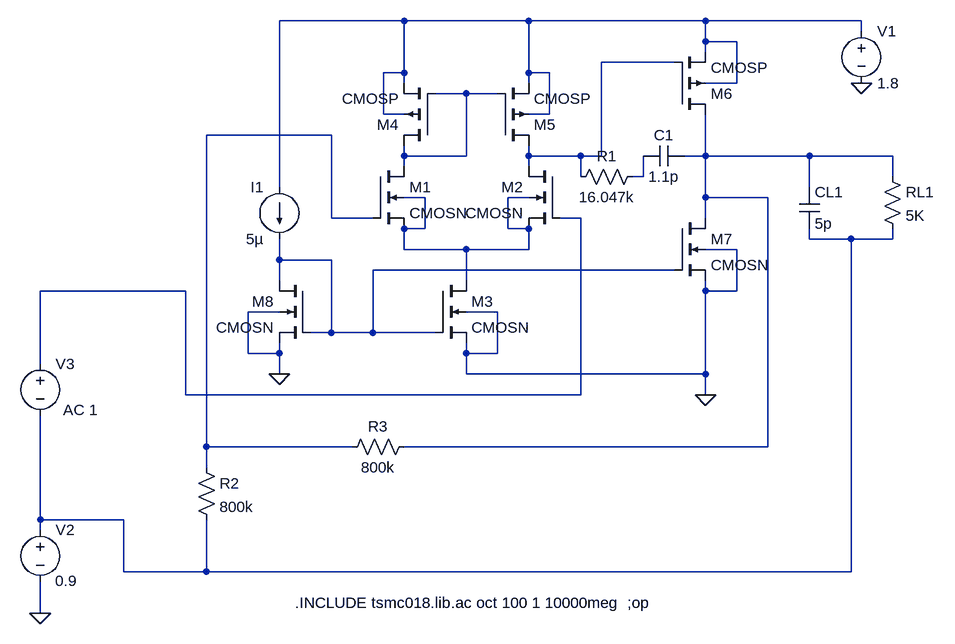
[diagram p0: schematic 2-stageOpamp_closeloop.asc]
2-stageOpamp_closeloop.asc, the LTspice schematic file:
Version 4
SHEET 1 880 680
WIRE -496 -544 -688 -544
WIRE -304 -544 -496 -544
WIRE -32 -544 -304 -544
WIRE 208 -544 -32 -544
WIRE 208 -528 208 -544
WIRE -32 -512 -32 -544
WIRE 16 -512 -32 -512
WIRE -32 -496 -32 -512
WIRE -80 -480 -192 -480
WIRE -496 -464 -496 -544
WIRE -496 -464 -528 -464
WIRE -304 -464 -304 -544
WIRE -272 -464 -304 -464
WIRE -496 -448 -496 -464
WIRE -304 -448 -304 -464
WIRE 16 -448 16 -512
WIRE 16 -448 -32 -448
WIRE -400 -432 -448 -432
WIRE -352 -432 -400 -432
WIRE -528 -400 -528 -464
WIRE -496 -400 -528 -400
WIRE -272 -400 -272 -464
WIRE -272 -400 -304 -400
WIRE -608 -368 -800 -368
WIRE -496 -336 -496 -352
WIRE -400 -336 -400 -432
WIRE -400 -336 -496 -336
WIRE -304 -336 -304 -352
WIRE -224 -336 -304 -336
WIRE -192 -336 -192 -480
WIRE -192 -336 -224 -336
WIRE -32 -336 -32 -400
WIRE -32 -336 -64 -336
WIRE 128 -336 -32 -336
WIRE 256 -336 128 -336
WIRE -496 -320 -496 -336
WIRE -304 -320 -304 -336
WIRE -224 -304 -224 -336
WIRE -128 -304 -128 -336
WIRE -128 -304 -144 -304
WIRE 256 -304 256 -336
WIRE -688 -288 -688 -544
WIRE 128 -288 128 -336
WIRE -464 -272 -496 -272
WIRE -304 -272 -336 -272
WIRE -32 -272 -32 -336
WIRE 64 -272 -32 -272
WIRE -608 -240 -608 -368
WIRE -544 -240 -608 -240
WIRE -224 -240 -256 -240
WIRE -32 -240 -32 -272
WIRE -464 -224 -464 -272
WIRE -464 -224 -496 -224
WIRE -336 -224 -336 -272
WIRE -304 -224 -336 -224
WIRE 128 -208 128 -224
WIRE 192 -208 128 -208
WIRE 256 -208 256 -224
WIRE 256 -208 192 -208
WIRE -496 -192 -496 -224
WIRE -400 -192 -496 -192
WIRE -304 -192 -304 -224
WIRE -304 -192 -400 -192
WIRE 16 -192 -32 -192
WIRE -688 -176 -688 -208
WIRE -608 -176 -688 -176
WIRE -80 -160 -544 -160
WIRE -688 -144 -688 -176
WIRE -400 -144 -400 -192
WIRE -832 -128 -1056 -128
WIRE -32 -128 -32 -144
WIRE 16 -128 16 -192
WIRE 16 -128 -32 -128
WIRE -688 -96 -736 -96
WIRE -352 -96 -400 -96
WIRE -608 -64 -608 -176
WIRE -608 -64 -640 -64
WIRE -544 -64 -544 -160
WIRE -544 -64 -608 -64
WIRE -448 -64 -544 -64
WIRE -736 -32 -736 -96
WIRE -688 -32 -688 -48
WIRE -688 -32 -736 -32
WIRE -400 -32 -400 -48
WIRE -352 -32 -352 -96
WIRE -352 -32 -400 -32
WIRE -1056 -16 -1056 -128
WIRE -688 0 -688 -32
WIRE -400 0 -400 -32
WIRE -32 0 -32 -128
WIRE -32 0 -400 0
WIRE -832 32 -832 -128
WIRE -224 32 -224 -240
WIRE -224 32 -832 32
WIRE -32 32 -32 0
WIRE -800 112 -800 -368
WIRE -576 112 -800 112
WIRE 64 112 64 -272
WIRE 64 112 -496 112
WIRE -800 144 -800 112
WIRE -1056 224 -1056 64
WIRE -928 224 -1056 224
WIRE -1056 240 -1056 224
WIRE -928 304 -928 224
WIRE -800 304 -800 224
WIRE -800 304 -928 304
WIRE 192 304 192 -208
WIRE 192 304 -800 304
WIRE -1056 368 -1056 320
FLAG -32 32 0
FLAG -688 0 0
FLAG 208 -448 0
FLAG -1056 368 0
SYMBOL cmosn -544 -320 R0
SYMATTR InstName M1
SYMATTR Value2 l=0.36u w=0.373824u
SYMBOL cmosn -256 -320 M0
SYMATTR InstName M2
SYMATTR Value2 l=0.36u w=0.373824u
SYMBOL cmosn -448 -144 R0
SYMATTR InstName M3
SYMATTR Value2 l=0.36u w=0.39132u
SYMBOL cmosp -448 -352 R180
SYMATTR InstName M4
SYMATTR Value2 l=0.36u w=0.45u
SYMBOL cmosp -352 -352 M180
SYMATTR InstName M5
SYMATTR Value2 l=0.36u w=0.45u
SYMBOL cap -64 -352 R90
WINDOW 0 0 32 VBottom 2
WINDOW 3 32 32 VTop 2
SYMATTR InstName C1
SYMATTR Value 1.1p
SYMBOL cmosp -80 -400 M180
SYMATTR InstName M6
SYMATTR Value2 l=0.36u w=6.22u
SYMBOL cmosn -80 -240 R0
SYMATTR InstName M7
SYMATTR Value2 l=0.36u w=2.7036u
SYMBOL cmosn -640 -144 M0
SYMATTR InstName M8
SYMATTR Value2 l=0.36u w=0.39132u
SYMBOL current -688 -288 M0
WINDOW 123 0 0 Left 2
WINDOW 39 0 0 Left 2
SYMATTR InstName I1
SYMATTR Value 5µ
SYMBOL voltage 208 -544 R0
WINDOW 123 0 0 Left 2
WINDOW 39 0 0 Left 2
SYMATTR InstName V1
SYMATTR Value 1.8
SYMBOL cap 112 -288 R0
SYMATTR InstName CL1
SYMATTR Value 5p
SYMBOL res 240 -320 R0
SYMATTR InstName RL1
SYMATTR Value 5K
SYMBOL voltage -1056 224 R0
WINDOW 123 24 124 Left 2
WINDOW 39 0 0 Left 2
WINDOW 3 23 94 Left 2
SYMATTR Value 0.9
SYMATTR InstName V2
SYMBOL res -128 -320 R90
WINDOW 0 0 56 VBottom 2
WINDOW 3 32 56 VTop 2
SYMATTR InstName R1
SYMATTR Value 16.047k
SYMBOL voltage -1056 -32 R0
WINDOW 3 24 44 Left 2
WINDOW 123 35 87 Left 2
WINDOW 39 0 0 Left 2
SYMATTR Value ""
SYMATTR Value2 AC 1
SYMATTR InstName V3
SYMBOL res -816 128 R0
SYMATTR InstName R2
SYMATTR Value 800k
SYMBOL res -480 96 R90
WINDOW 0 0 56 VBottom 2
WINDOW 3 32 56 VTop 2
SYMATTR InstName R3
SYMATTR Value 800k
TEXT -424 352 Left 2 !.ac oct 100 1 10000meg
TEXT -664 352 Left 2 !.INCLUDE tsmc018.lib
TEXT -152 352 Left 2 !;op

The netlist it stands for:
* 2-stageOpamp_closeloop.asc
M1 N003 N004 N007 N007 CMOSN l=0.36u w=0.373824u
M2 N002 N008 N007 N007 CMOSN l=0.36u w=0.373824u
M3 N007 N010 0 0 CMOSN l=0.36u w=0.39132u
M4 N003 N003 N001 N001 CMOSP l=0.36u w=0.45u
M5 N002 N003 N001 N001 CMOSP l=0.36u w=0.45u
C1 N005 N006 1.1p
M6 N005 N002 N001 N001 CMOSP l=0.36u w=6.22u
M7 N005 N010 0 0 CMOSN l=0.36u w=2.7036u
M8 N010 N010 0 0 CMOSN l=0.36u w=0.39132u
I1 N001 N010 5µ
V1 N001 0 1.8
CL1 N005 N009 5p
RL1 N005 N009 5K
V2 N009 0 0.9
R1 N006 N002 16.047k
V3 N008 N009 AC 1
R2 N004 N009 800k
R3 N005 N004 800k
.model NMOS NMOS
.model PMOS PMOS
.lib standard.mos
.ac oct 100 1 10000meg
.INCLUDE tsmc018.lib
;op
.backanno
.end